# Altium schematic sheet SchmitOpto.SchDoc
size A4
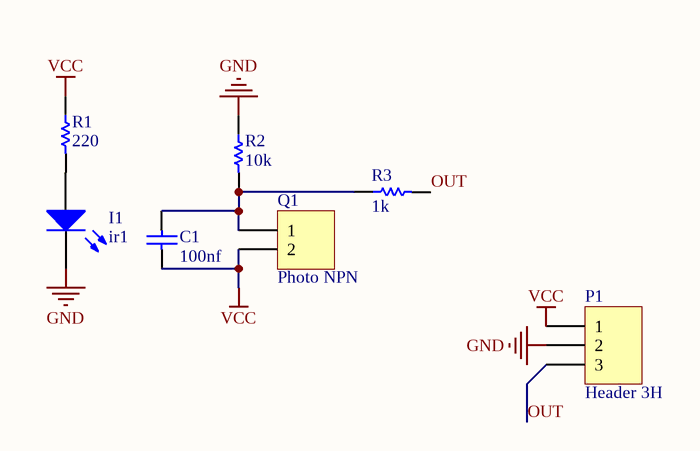
[diagram p0: SchmitOpto.SchDoc]

## Parts
C1  value 100nf  [6-0805_M]  (hidden comment: Cap)
I1  ir1  [HDR1X2]
P1  Header 3H  [HDR1X3H]
Q1  Photo NPN  [HDR1X2]
R1  220  [6-0805_M]
R2  10K  [6-0805_M]
R3  1K  [6-0805_M]

## Nets
GND: I1.2(K) P1.2 R2.1
VCC: C1.2 P1.1 Q1.2 R1.1
OUT: P1.3 R3.2
NetC1_1: C1.1 Q1.1 R2.2 R3.1
NetI1_1: I1.1(A) R1.2

## Library data of the parts
C1 = Cap: Capacitor; Published: 8-Jun-2000; LatestRevisionDate: 17-Jul-2002; LatestRevisionNote: Re-released for DXP Platform.; PackageReference: RAD-0.3; Publisher: Altium Limited; PackageDescription: Radial Cap, Thru-Hole; 2 Leads; 0.3 in Pin Spacing
I1 = LED0: Typical INFRARED GaAs LED; Published: 8-Jun-2000; LatestRevisionDate: 08-Jul-2005; LatestRevisionNote: Mech Layer 1 removed.; PackageReference: LED-0; Publisher: Altium Limited; PackageDescription: LED; 2 Leads
P1 = Header 3H: Header, 3-Pin, Right Angle; LatestRevisionDate: 17-Jul-2002; LatestRevisionNote: Re-released for DXP Platform.; Publisher: Altium Limited
Q1 = Header 2: Header, 2-Pin; LatestRevisionDate: 17-Jul-2002; LatestRevisionNote: Re-released for DXP Platform.; Publisher: Altium Limited
R1-R3 = Res1: Resistor; Published: 8-Jun-2000; LatestRevisionDate: 17-Jul-2002; LatestRevisionNote: Re-released for DXP Platform.; PackageReference: AXIAL-0.3; Publisher: Altium Limited; PackageDescription: Axial Device, Thru-Hole; 2 Leads; 0.3 in Pin Spacing
  R1: Value: 220
  R2: Value: 10k
  R3: Value: 1k